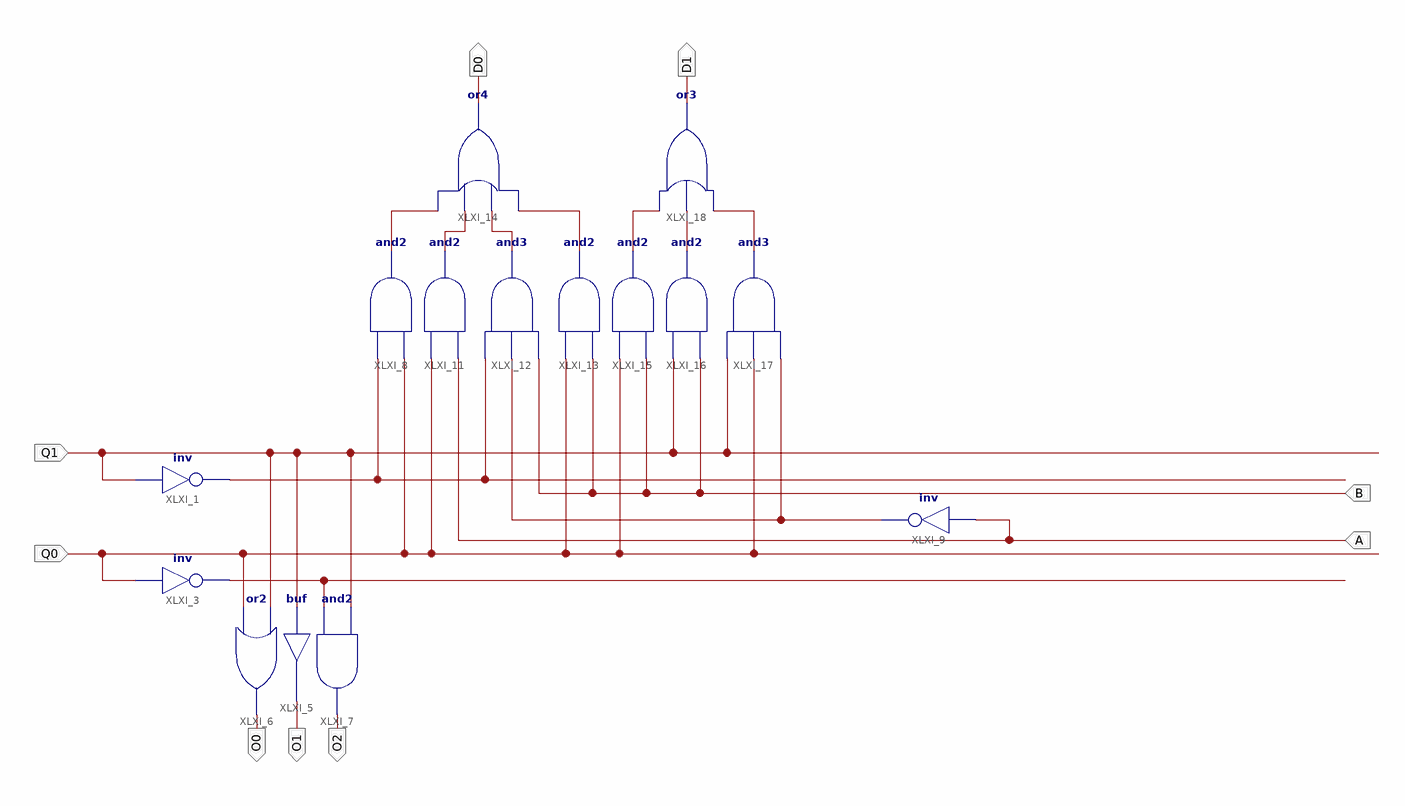
[diagram p0: schematic sheet 1]
// Xilinx ISE schematic ctrl_v1.sch (spartan3) as structural Verilog: 15 symbols, 9 ports
module ctrl_v1 (
  input  Q1,
  input  Q0,
  input  B,
  input  A,
  output O1,
  output D0,
  output D1,
  output O0,
  output O2
);

  wire XLXN_2, XLXN_14, XLXN_21, XLXN_24, XLXN_25, XLXN_26, XLXN_27, XLXN_30, XLXN_31, XLXN_32;

  not XLXI_1 (XLXN_2, Q1);
  not XLXI_3 (XLXN_14, Q0);
  buf XLXI_5 (O1, Q1);
  or XLXI_6 (O0, Q0, Q1);
  and XLXI_7 (O2, XLXN_14, Q1);
  and XLXI_8 (XLXN_25, Q0, XLXN_2);
  not XLXI_9 (XLXN_21, A);
  and XLXI_11 (XLXN_24, A, Q0);
  and XLXI_12 (XLXN_26, B, XLXN_21, XLXN_2);
  and XLXI_13 (XLXN_27, B, Q0);
  or XLXI_14 (D0, XLXN_27, XLXN_26, XLXN_24, XLXN_25);
  and XLXI_15 (XLXN_30, B, Q0);
  and XLXI_16 (XLXN_31, B, Q1);
  and XLXI_17 (XLXN_32, XLXN_21, Q0, Q1);
  or XLXI_18 (D1, XLXN_32, XLXN_31, XLXN_30);
endmodule
